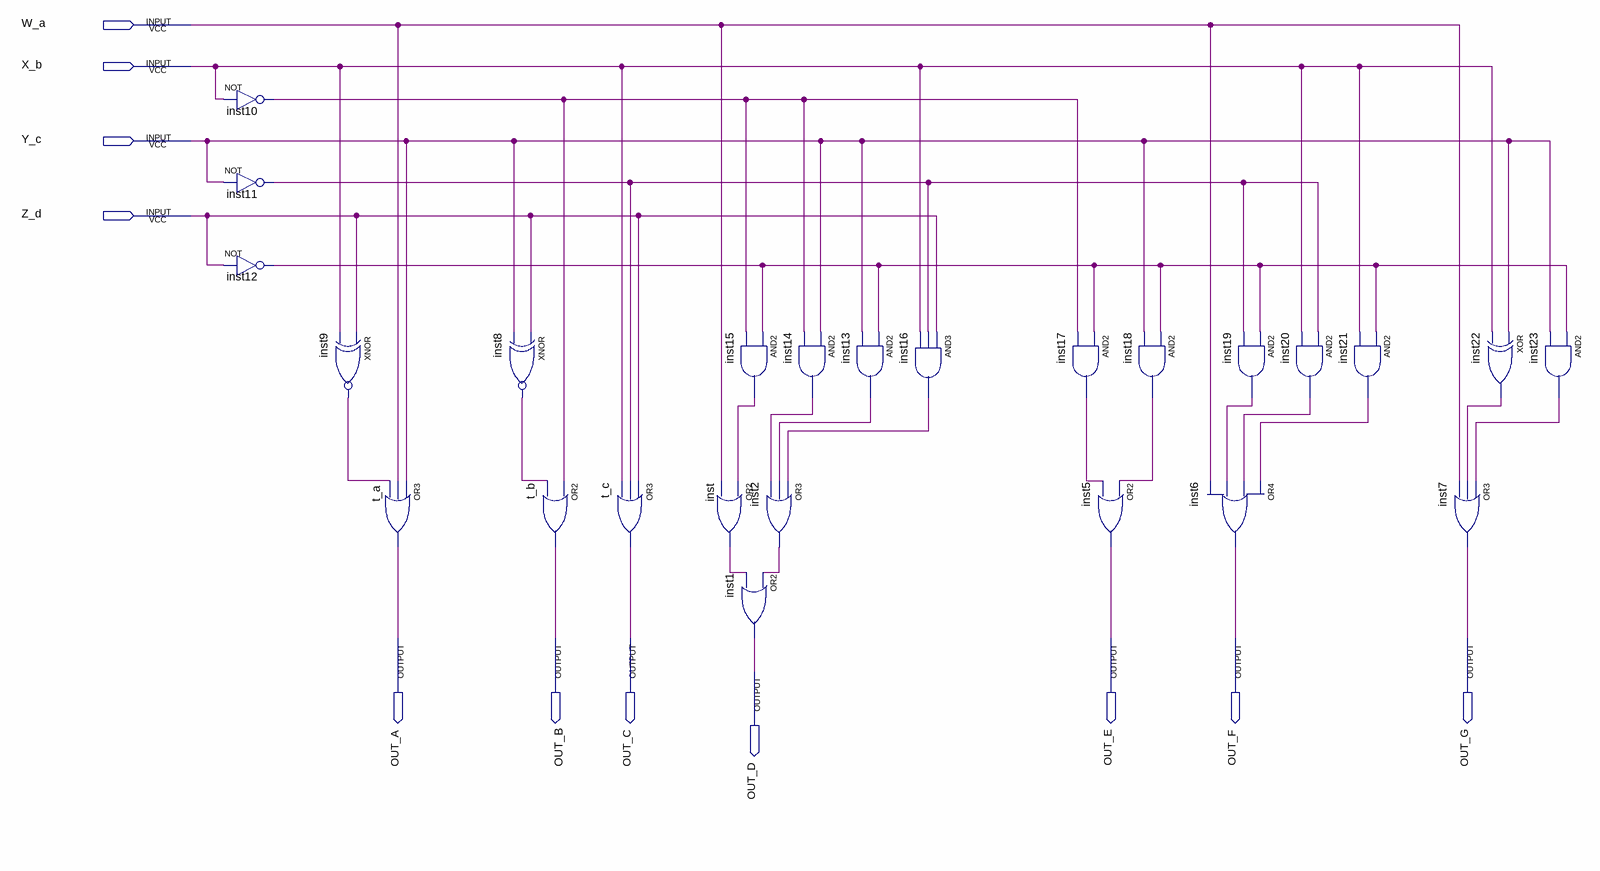
[diagram p0: schematic sheet]
// Quartus schematic Display_7_Segmentos.bdf as structural Verilog: 25 symbols, 11 pins
module Display_7_Segmentos (
  input  W_a,
  input  X_b,
  input  Y_c,
  input  Z_d,
  output OUT_A,
  output OUT_B,
  output OUT_C,
  output OUT_E,
  output OUT_F,
  output OUT_G,
  output OUT_D
);

  wire inst2_out, inst8_out, inst9_out, inst10_out, inst11_out, inst12_out, inst13_out, inst14_out,
       inst15_out, inst16_out, inst17_out, inst18_out, inst19_out, inst20_out, inst21_out, inst22_out,
       inst23_out, inst_out;

  not inst10 (inst10_out, X_b);
  not inst11 (inst11_out, Y_c);
  not inst12 (inst12_out, Z_d);
  xnor inst9 (inst9_out, Z_d, X_b);
  or t_a (OUT_A, Y_c, W_a, inst9_out);
  xnor inst8 (inst8_out, Z_d, Y_c);
  or t_b (OUT_B, inst10_out, inst8_out);
  or t_c (OUT_C, Z_d, inst11_out, X_b);
  or inst (inst_out, inst15_out, W_a);
  and inst14 (inst14_out, Y_c, inst10_out);
  and inst15 (inst15_out, inst12_out, inst10_out);
  or inst2 (inst2_out, inst16_out, inst13_out, inst14_out);
  or inst1 (OUT_D, inst2_out, inst_out);
  and inst13 (inst13_out, inst12_out, Y_c);
  and inst16 (inst16_out, Z_d, inst11_out, X_b);
  and inst17 (inst17_out, inst12_out, inst10_out);
  or inst5 (OUT_E, inst18_out, inst17_out);
  and inst18 (inst18_out, inst12_out, Y_c);
  and inst19 (inst19_out, inst12_out, inst11_out);
  or inst6 (OUT_F, inst21_out, inst20_out, inst19_out, W_a);
  and inst20 (inst20_out, inst11_out, X_b);
  and inst21 (inst21_out, inst12_out, X_b);
  or inst7 (OUT_G, inst23_out, inst22_out, W_a);
  xor inst22 (inst22_out, Y_c, X_b);
  and inst23 (inst23_out, inst12_out, Y_c);
endmodule
